# EAGLE design sensor_potensio (EAGLE 9.5.0)
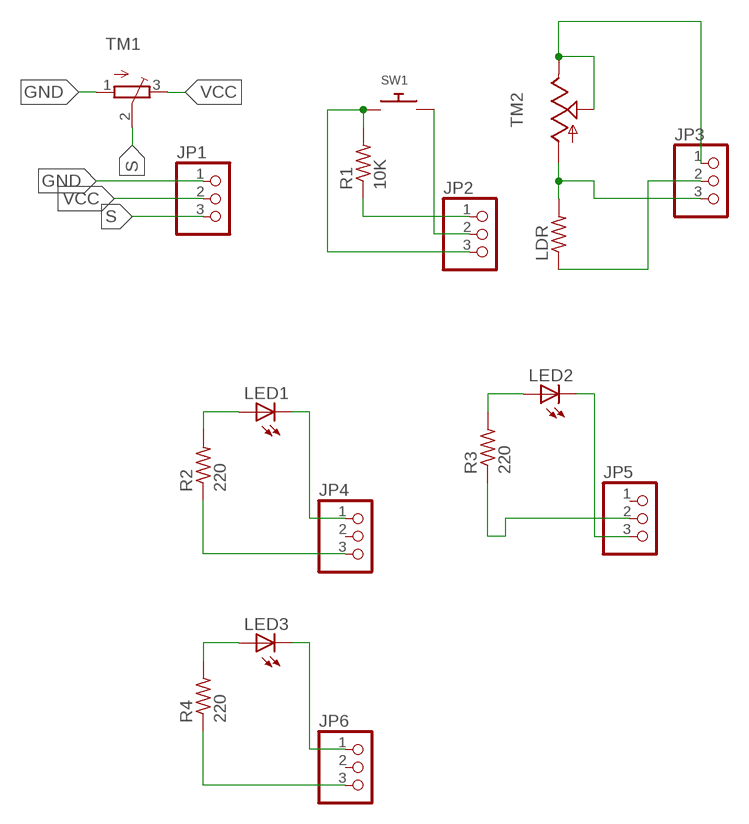
[diagram p0: schematic, sheet 1]

## Parts
JP1  PINHD-1X3  [1X03]
JP2  PINHD-1X3  [1X03]
JP3  PINHD-1X3  [1X03]
JP4  PINHD-1X3  [1X03]
JP5  PINHD-1X3  [1X03]
JP6  PINHD-1X3  [1X03]
LDR  R-US_0204/5  [0204/5]
LED1  LED5MM  [LED5MM]
LED2  LED5MM  [LED5MM]
LED3  LED5MM  [LED5MM]
R1  10K  R-US_0207/7  [0207/7]
R2  220  R-US_0207/7  [0207/7]
R3  220  R-US_0207/7  [0207/7]
R4  220  R-US_0207/7  [0207/7]
SW1  SWITCH_PUSHBUTTONEVQ-PE  [TACT_PANA-EVQ]
TM1  TRIMPOT3386  [TRIM-3386]
TM2  TRIM  [6MM]

## Nets
GND: JP1.1 TM1.1(A)
N$1: JP2.3 R1.2 SW1.P$1
N$2: JP2.1 R1.1
N$3: JP2.2 SW1.P$2
N$4: JP3.3 LDR.2 TM2.A
N$5: JP3.1 TM2.E TM2.S
N$6: JP3.2 LDR.1
N$7: LED1.A R2.2
N$8: JP4.3 R2.1
N$9: JP4.1 LED1.K(C)
N$10: LED2.A R3.2
N$11: JP5.2 R3.1
N$12: LED3.A R4.2
N$13: JP5.3 LED2.K(C)
N$14: JP6.3 R4.1
N$15: JP6.1 LED3.K(C)
S: JP1.3 TM1.2(S)
VCC: JP1.2 TM1.3(E)
Unconnected: JP4.2 JP5.1 JP6.2

## Library data of the parts
JP1-JP6 = adafruit_arduino:PINHD-1X3: PIN HEADER
LDR = resistor:R-US_: RESISTOR, American symbol
LED1-LED3 = adafruit_arduino:LED: LED OSRAM: - CHIPLED LG R971, LG N971, LY N971, LG Q971, LY Q971, LO R971, LY R971 LH N974, LH R974 LS Q976, LO Q976, LY Q976 LO Q996 - Hyper CHIPLED LW Q18S LB Q993, LB Q99A, LB R99A - SideLED LS A670, LO A670, LY A670, LG A670, LP A670 LB A673, LV A673, LT A673, LW A673 LH A674 LY A675 LS A676, LA A676, LO A676, LY A676, LW A676 LS A679, LY A679, LG A679 - Hyper Micro SIDELED® LS Y876, LA Y876, LO Y876, LY Y876 LT Y87S - SmartLED LW L88C, LW L88S LB L89C, LB L89S, LG L890 LS L89K, LO L89K, LY L89K LS L896, LA L896, LO L896, LY L896 - TOPLED LS T670, LO T670, LY T670, LG T670, LP T670 LSG T670, LSP T670, LSY T670, LOP T670, LYG T670 LG T671, LOG T671, LSG T671 LB T673, LV T673, LT T673, LW T673 LH T674 LS T676, LA T676, LO T676, LY T676, LB T676, LH T676, LSB T676, LW T676 LB T67C, LV T67C, LT T67C, LS T67K, LO T67K, LY T67K, LW E67C LS E67B, LA E67B, LO E67B, LY E67B, LB E67C, LV E67C, LT E67C LW T67C LS T679, LY T679, LG T679 LS T770, LO T770, LY T770, LG T770, LP T770 LB T773, LV T773, LT T773, LW T773 LH T774 LS E675, LA E675, LY E675, LS T675 LS T776, LA T776, LO T776, LY T776, LB T776 LHGB T686 LT T68C, LB T68C - Hyper Mini TOPLED® LB M676 - Mini TOPLED Santana® LG M470 LS M47K, LO M47K, LY M47K Source: http://www.osram.convergy.de/
R1-R4 = adafruit_arduino:R-US_: RESISTOR, American symbol
SW1 = adafruit_arduino:SWITCH_PUSHBUTTON: Buttons SOFTTOUCHSMD_SJ - Soft touch temporary push button (Super Junk Akihabara) Compatible with SKPMANE010 [Mouser: 688-SKPMAN] C&K_KSS = Digikey: KSS221GLFS
TM1 = adafruit_arduino:TRIMPOT: SMT trimmer potentiometer part number TC33X http://www.ladyada.net/library/eagle
TM2 = adafruit_arduino:TRIM

## Board
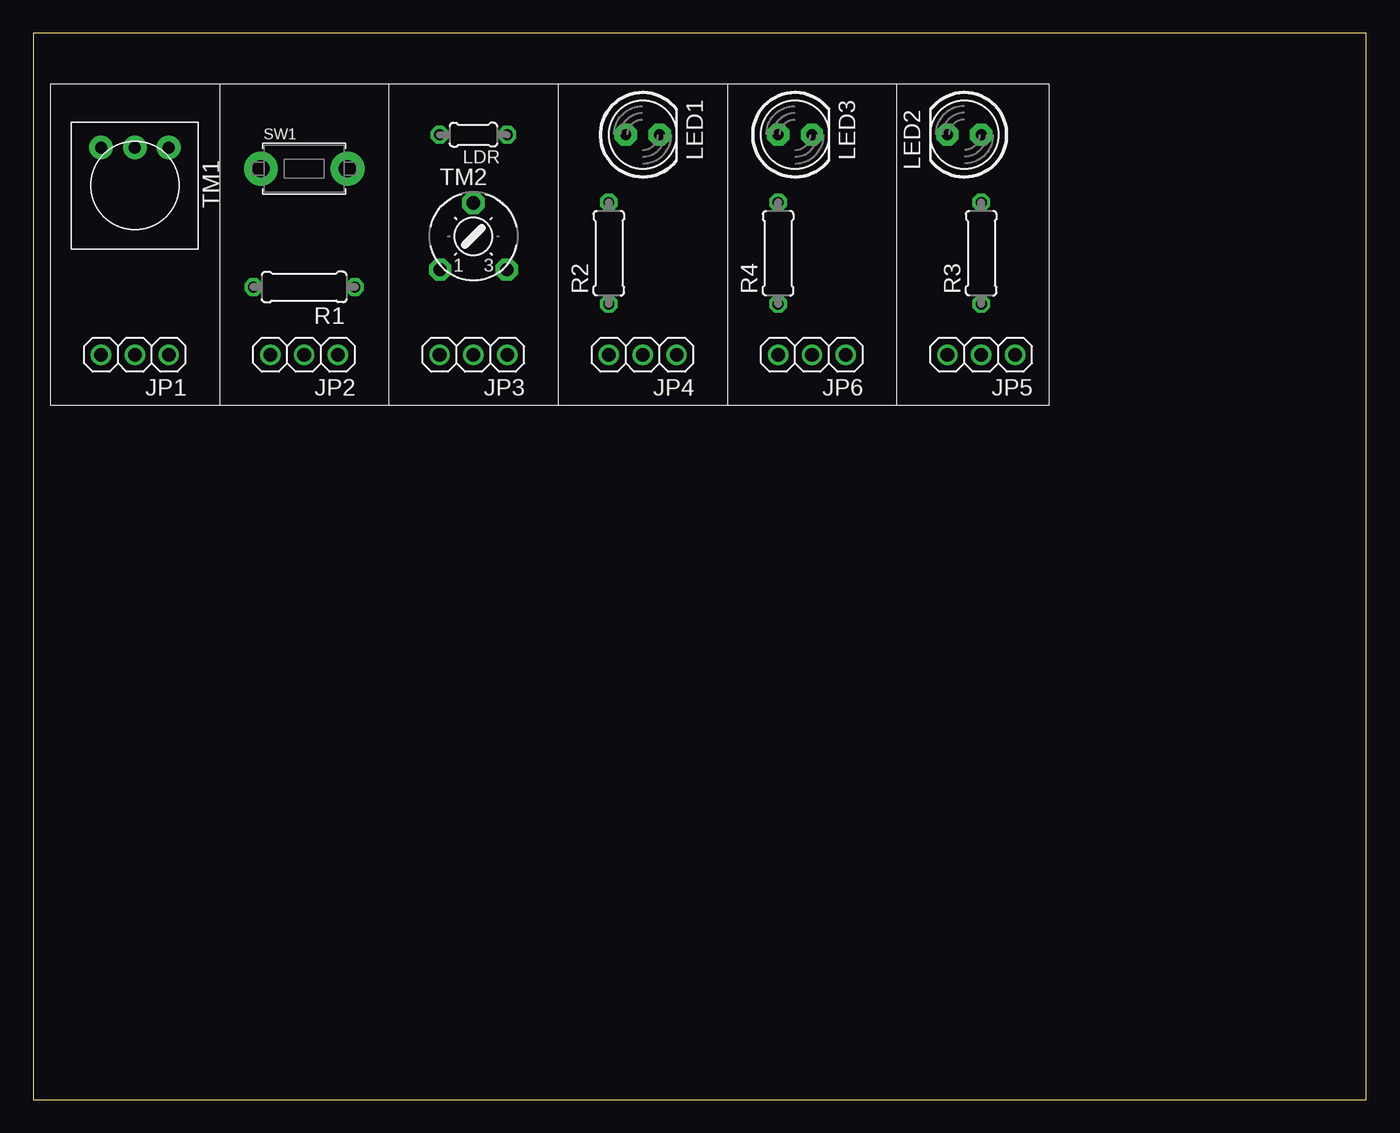
[diagram p1: board, top side]
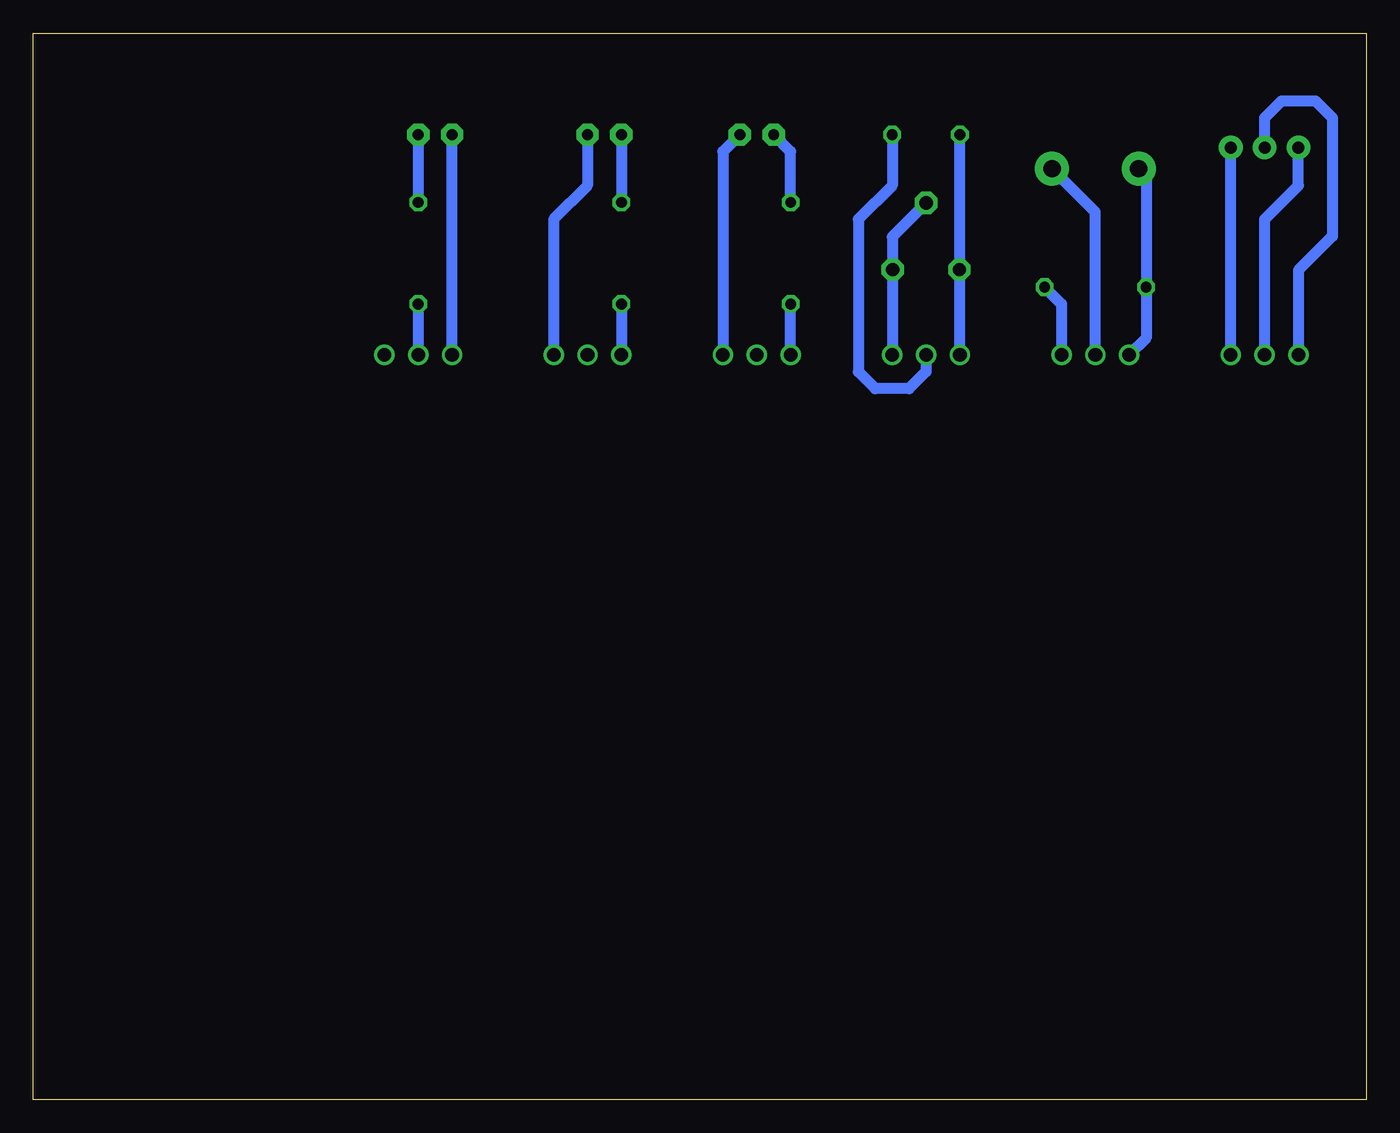
[diagram p2: board, bottom side, seen from below]

Size 100 x 80 mm. Coordinates in mm from the lower left corner, seen from the top.
Outline: 0,0 100,0 100,80 0,80 0,0
Copper layers (1*16): Top 0.035mm / dielectric 1.5mm / Bottom 0.035mm
Design rules "default": minimum track width 6mil, minimum drill 0.35mm, track to track 6mil, track to pad 6mil, pad to pad 6mil, via to via 6mil, smd to smd 6mil, copper to edge 40mil, drill to drill 6mil, minimum pad ring 10mil, minimum via ring 8mil, stop-mask expansion 4mil, vias tented up to drill 0mil, thermal gap 10mil

### Footprints (pad centres in the part's own frame; a part is rotated, then mirrored left to right if it is on the bottom)
1X03 = drill 1.016: 1 -2.54,0; 2 0,0; 3 2.54,0
0204/5 = drill 0.813 octagon: 1 -2.54,0; 2 2.54,0
LED5MM = drill 0.813 pad 1.676 octagon: A -1.27,0; K 1.27,0
0207/7 = drill 0.813 octagon: 1 -3.81,0; 2 3.81,0
TACT_PANA-EVQ = drill 1.3 pad 2.54: P$1 -3.25,0; P$2 3.25,0
TRIM-3386 = drill 0.9 pad 1.778: 1 -2.54,-2.857; 2 0,-2.857; 3 2.54,-2.857
6MM = drill 1 pad 1.676 octagon: A -2.5,-2.5; E 2.5,-2.5; S 0,2.5

### Placement (x,y rotation side)
JP1  7.62,55.88 180 top
JP2  20.32,55.88 180 top
JP3  33.02,55.88 180 top
JP4  45.72,55.88 180 top
JP5  71.12,55.88 180 top
JP6  58.42,55.88 180 top
LDR  33.02,72.39 180 top
LED1  45.72,72.39 0 top
LED2  69.85,72.39 180 top
LED3  57.15,72.39 0 top
R1  20.32,60.96 180 top
R2  43.18,63.5 90 top
R3  71.12,63.5 90 top
R4  55.88,63.5 90 top
SW1  20.32,69.85 0 top
TM1  7.62,68.58 180 top
TM2  33.02,64.77 0 top

### Tracks (layer width: path | path; a pad name or v marks a point on that pad's centre or on a via)
GND
  Bottom 0.813: JP1.1 TM1.1
N$1
  Bottom 0.813: JP2.3 16.51,57.15 R1.2 16.51,69.29 SW1.P$1
N$2
  Bottom 0.813: R1.1 22.86,59.69 JP2.1
N$3
  Bottom 0.813: JP2.2 20.32,66.6 SW1.P$2
N$4
  Bottom 0.813: JP3.3 30.48,62.23 TM2.A 30.48,62.31 LDR.2
N$5
  Bottom 0.813: TM2.S 35.56,64.73 | 35.56,64.73 JP3.1 | TM2.E 35.52,64.69 35.56,64.73
N$6
  Bottom 0.813: JP3.2 33.02,54.61 34.29,53.34 36.83,53.34 38.1,54.61 38.1,66.04 35.56,68.58 LDR.1
N$7
  Bottom 0.813: R2.2 43.18,71.12 LED1.A
N$8
  Bottom 0.813: JP4.3 R2.1
N$9
  Bottom 0.813: LED1.K 48.26,71.12 JP4.1
N$10
  Bottom 0.813: LED2.A R3.2
N$11
  Bottom 0.813: R3.1 JP5.2
N$12
  Bottom 0.813: LED3.A R4.2
N$13
  Bottom 0.813: JP5.3 LED2.K
N$14
  Bottom 0.813: R4.1 JP6.3
N$15
  Bottom 0.813: LED3.K 58.42,68.58 60.96,66.04 JP6.1
S
  Bottom 0.813: TM1.2 7.62,73.66 6.35,74.93 3.81,74.93 2.54,73.66 2.54,64.77 5.08,62.23 JP1.3
VCC
  Bottom 0.813: JP1.2 7.62,66.04 5.08,68.58 TM1.3